# EAGLE design TheSixthSense (EAGLE 6.1)
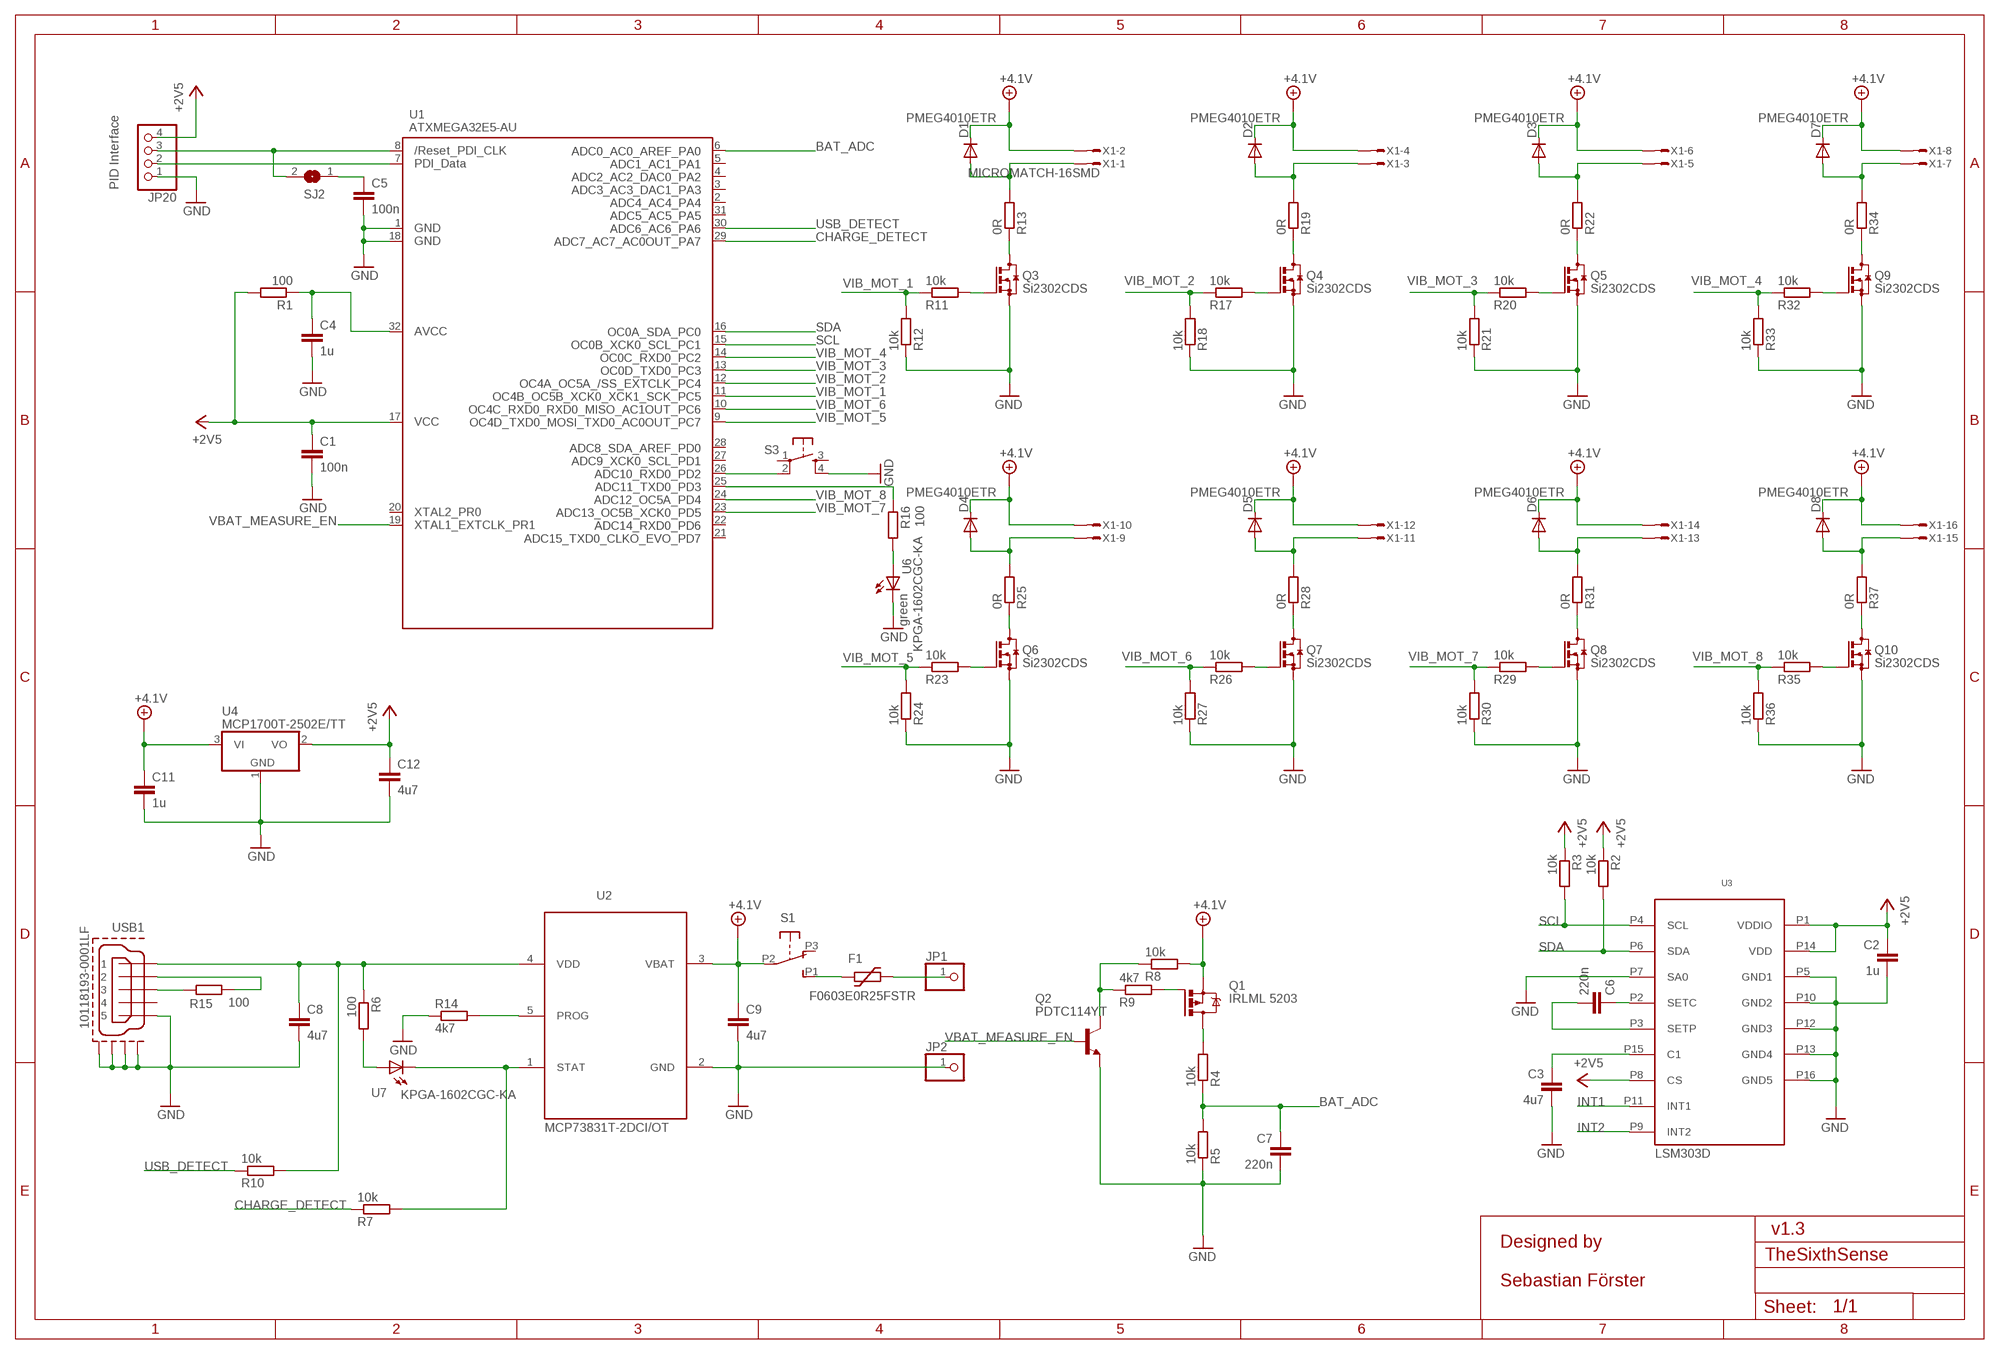
[diagram p0: schematic, sheet 1]

## Parts
C1  100n  C-EUC0603  [C0603]
C2  1u  C-EUC0603  [C0603]
C3  4u7  C-EUC0603  [C0603]
C4  1u  C-EUC0603  [C0603]
C5  100n  C-EUC0603  [C0603]
C6  220n  C-EUC0603  [C0603]
C7  220n  C-EUC0603  [C0603]
C8  4u7  C-EUC0603  [C0603]
C9  4u7  C-EUC0603  [C0603]
C11  1u  C-EUC0603  [C0603]
C12  4u7  C-EUC0603  [C0603]
D1  PMEG4010ETR  MBR0520LT  [SOD123]
D2  PMEG4010ETR  MBR0520LT  [SOD123]
D3  PMEG4010ETR  MBR0520LT  [SOD123]
D4  PMEG4010ETR  MBR0520LT  [SOD123]
D5  PMEG4010ETR  MBR0520LT  [SOD123]
D6  PMEG4010ETR  MBR0520LT  [SOD123]
D7  PMEG4010ETR  MBR0520LT  [SOD123]
D8  PMEG4010ETR  MBR0520LT  [SOD123]
F1  F0603E0R25FSTR  PMS1812  [R0603]
JP1  PINHD-1X1  [1X01]
JP2  PINHD-1X1  [1X01]
JP20  PINHD-1X4_2.00  [1X04M]
Q1  IRLML 5203  IRLML5203  [MICRO3]
Q2  PDTC114YT  BC848ALT1SMD  [SOT23]
Q3  Si2302CDS  BSS123  [SOT23]
Q4  Si2302CDS  BSS123  [SOT23]
Q5  Si2302CDS  BSS123  [SOT23]
Q6  Si2302CDS  BSS123  [SOT23]
Q7  Si2302CDS  BSS123  [SOT23]
Q8  Si2302CDS  BSS123  [SOT23]
Q9  Si2302CDS  BSS123  [SOT23]
Q10  Si2302CDS  BSS123  [SOT23]
R1  100  R-EU_R0603  [R0603]
R2  10k  R-EU_R0603  [R0603]
R3  10k  R-EU_R0603  [R0603]
R4  10k  R-EU_R0603  [R0603]
R5  10k  R-EU_R0603  [R0603]
R6  100  R-EU_R0603  [R0603]
R7  10k  R-EU_R0603  [R0603]
R8  10k  R-EU_R0603  [R0603]
R9  4k7  R-EU_R0603  [R0603]
R10  10k  R-EU_R0603  [R0603]
R11  10k  R-EU_R0603  [R0603]
R12  10k  R-EU_R0603  [R0603]
R13  0R  R-EU_R0603  [R0603]
R14  4k7  R-EU_R0603  [R0603]
R15  100  R-EU_R0603  [R0603]
R16  100  R-EU_R0603  [R0603]
R17  10k  R-EU_R0603  [R0603]
R18  10k  R-EU_R0603  [R0603]
R19  0R  R-EU_R0603  [R0603]
R20  10k  R-EU_R0603  [R0603]
R21  10k  R-EU_R0603  [R0603]
R22  0R  R-EU_R0603  [R0603]
R23  10k  R-EU_R0603  [R0603]
R24  10k  R-EU_R0603  [R0603]
R25  0R  R-EU_R0603  [R0603]
R26  10k  R-EU_R0603  [R0603]
R27  10k  R-EU_R0603  [R0603]
R28  0R  R-EU_R0603  [R0603]
R29  10k  R-EU_R0603  [R0603]
R30  10k  R-EU_R0603  [R0603]
R31  0R  R-EU_R0603  [R0603]
R32  10k  R-EU_R0603  [R0603]
R33  10k  R-EU_R0603  [R0603]
R34  0R  R-EU_R0603  [R0603]
R35  10k  R-EU_R0603  [R0603]
R36  10k  R-EU_R0603  [R0603]
R37  0R  R-EU_R0603  [R0603]
S1  ALPSSSSS811101  [SSSS811101]
S3  10-XX  [SKSCLAE010]
SJ2  SJ  [SJ]
U1  ATXMEGA32E5-AU  AVR_XMEGA_E  [TQFP32-08]
U2  MCP73831  [SOT23-5L]
U3  LSM303D  [LGA3X3_16L]
U4  MCP1700T-2502E/TT  XC6206P332MR  [SOT23]
U6  KPGA-1602CGC-KA  APA1606SURCK  [CHIP-LED0603]
U7  KPGA-1602CGC-KA  APA1606SURCK  [CHIP-LED0603]
USB1  10118193-0001LF  MOLEX-47346-0001  [MOLEX-47364-0001]
X1  MICROMATCH-16SMD  [MICROMATCH-16SMD]

## Nets
+3V3: C1.1 C2.1 C12.1 JP20.4 R1.2 R2.1 R3.1 U1.17(VCC3) U3.P1(VDDIO) U3.P8(CS) U3.P14(VDD) U4.2(VO) ; supply symbol labelled +2V5
+4.1V: C9.1 C11.1 D1.C D2.C D3.C D4.C D5.C D6.C D7.C D8.C Q1.2(S) R8.2 S1.P2(P) U2.3(VBAT) U4.3(VI) X1.1 X1.3 X1.5 X1.7 X1.9 X1.11 X1.13 X1.15
BAT_ADC: C7.1 R4.1 R5.2 U1.6(PA0)
CHARGE_DETECT: R7.1 U1.29(PA7)
GND: C1.2 C2.2 C3.2 C4.2 C5.2 C7.2 C8.2 C9.2 C11.2 C12.2 JP2.1 JP20.1 Q2.2(E) Q3.2(S) Q4.2(S) Q5.2(S) Q6.2(S) Q7.2(S) Q8.2(S) Q9.2(S) Q10.2(S) R5.1 R12.1 R14.1 R18.1 R21.1 R24.1 R27.1 R30.1 R33.1 R36.1 S3.4(S1) U1.1(GND1) U1.18(GND2) U2.2(GND) U3.P5(GND1) U3.P7(SA0) U3.P10(GND2) U3.P12(GND3) U3.P13(GND4) U3.P16(GND5) U4.1(GND) U6.C USB1.5 USB1.GND1 USB1.GND2 USB1.GND3 USB1.GND4
GPS_ENABLE: Q2.3(C) R8.1 R9.1
INT1: U3.P11(INT1)
INT2: U3.P9(INT2)
N$1: C6.2 U3.P3(SETP)
N$2: Q1.3(D) R4.2
N$3: C3.1 U3.P15(C1)
N$4: C6.1 U3.P2(SETC)
N$5: F1.1 S1.P1(S)
N$6: R6.2 U7.A
N$7: C8.1 R6.1 R10.2 U2.4(VDD) USB1.1
N$8: C5.1 SJ2.1
N$9: C4.1 R1.1 U1.32(AVCC)
N$10: JP20.3 SJ2.2 U1.8(RESET)
N$11: JP20.2 U1.7(PDI_DATA)
N$12: R14.2 U2.5(PROG)
N$13: R15.1 USB1.3
N$14: Q1.1(G) R9.2
N$15: Q3.1(G) R11.2
N$16: Q3.3(D) R13.1
N$17: D1.A R13.2 X1.16
N$18: R15.2 USB1.2
N$19: Q4.1(G) R17.2
N$20: Q4.3(D) R19.1
N$21: D2.A R19.2 X1.14
N$22: Q5.1(G) R20.2
N$23: Q5.3(D) R22.1
N$24: D3.A R22.2 X1.12
N$25: Q6.1(G) R23.2
N$26: R16.2 U6.A
N$27: Q6.3(D) R25.1
N$28: D4.A R25.2 X1.8
N$29: Q7.1(G) R26.2
N$30: Q7.3(D) R28.1
N$31: D5.A R28.2 X1.6
N$32: Q8.1(G) R29.2
N$33: Q8.3(D) R31.1
N$34: D6.A R31.2 X1.4
N$35: F1.2 JP1.1
N$36: S3.2(P1) U1.26(PD2)
N$38: R16.1 U1.25(PD3)
N$43: Q9.1(G) R32.2
N$44: Q9.3(D) R34.1
N$45: D7.A R34.2 X1.10
N$46: Q10.1(G) R35.2
N$47: Q10.3(D) R37.1
N$48: D8.A R37.2 X1.2
NNNN: R7.2 U2.1(STAT) U7.C
SCL: R3.2 U1.15(PC1) U3.P4(SCL)
SDA: R2.2 U1.16(PC0) U3.P6(SDA)
USB_DETECT: R10.1 U1.30(PA6)
VBAT_MEASURE_EN: Q2.1(B) U1.19(PR1)
VIB_MOT_1: R11.1 R12.2 U1.11(PC5)
VIB_MOT_2: R17.1 R18.2 U1.12(PC4)
VIB_MOT_3: R20.1 R21.2 U1.13(PC3)
VIB_MOT_4: R32.1 R33.2 U1.14(PC2)
VIB_MOT_5: R23.1 R24.2 U1.9(PC7)
VIB_MOT_6: R26.1 R27.2 U1.10(PC6)
VIB_MOT_7: R29.1 R30.2 U1.23(PD5)
VIB_MOT_8: R35.1 R36.2 U1.24(PD4)
Unconnected: S1.P3(O) S3.1(P) S3.3(S) U1.2(PA4) U1.3(PA3) U1.4(PA2) U1.5(PA1) U1.20(PR0) U1.21(PD7) U1.22(PD6) U1.27(PD1) U1.28(PD0) U1.31(PA5) USB1.4

## Notes on the sheet
- PID Interface
- green
- MCP73831T-2DCI/OT
- LSM303D
- v1.3
- Designed by
- Sebastian Förster

## Library data of the parts
C1-C9 C11 C12 = rcl:C-EU: CAPACITOR, European symbol
D1-D8 = diode:MBR0520LT: SCHOTTKY BARRIER RECTIFIER Source: http://onsemi.com .. MBR0520LT1-D.pdf
F1 = ptc-littlefuse:PMS1812: PMS1812-050 PPTC .5A 15V 1812
JP1 JP2 = pinhead:PINHD-1X1: PIN HEADER
JP20 = pinhead:PINHD-1X4: PIN HEADER
Q1 = transistor-power:IRLML5203: HEXFET P-Channel Power MOSFET
Q2 = transistor-npn:BC848*: NPN Transistor
Q3-Q10 = transistor-small-signal:BSS123: N-CHANNEL MOS FET
R1-R37 = rcl:R-EU_: RESISTOR, European symbol
S1 = ALP_Switch:ALPSSSSS811101
S3 = smd_right_switch:10-XX: OMRON SWITCH
SJ2 = jumper:SJ: SMD solder JUMPER
U1 = xmega:AVR_XMEGA_E
U2 = MCP73831:MCP73831
U3 = LSM303D:LSM303D
U4 = LDO_AAT3220:XC6206P332MR
U6 U7 = led_sideview:APA1606SURCK
USB1 = usb_con-update:MOLEX-47346-0001: MICRO USB B, BOTTOM MOUNT
X1 = Con-amp-micromatch:MICROMATCH-16: MicroMaTch 16 8-215464-6 / 1-215464-6 Drawing Number C-215464 DDEController.pdf

## Board
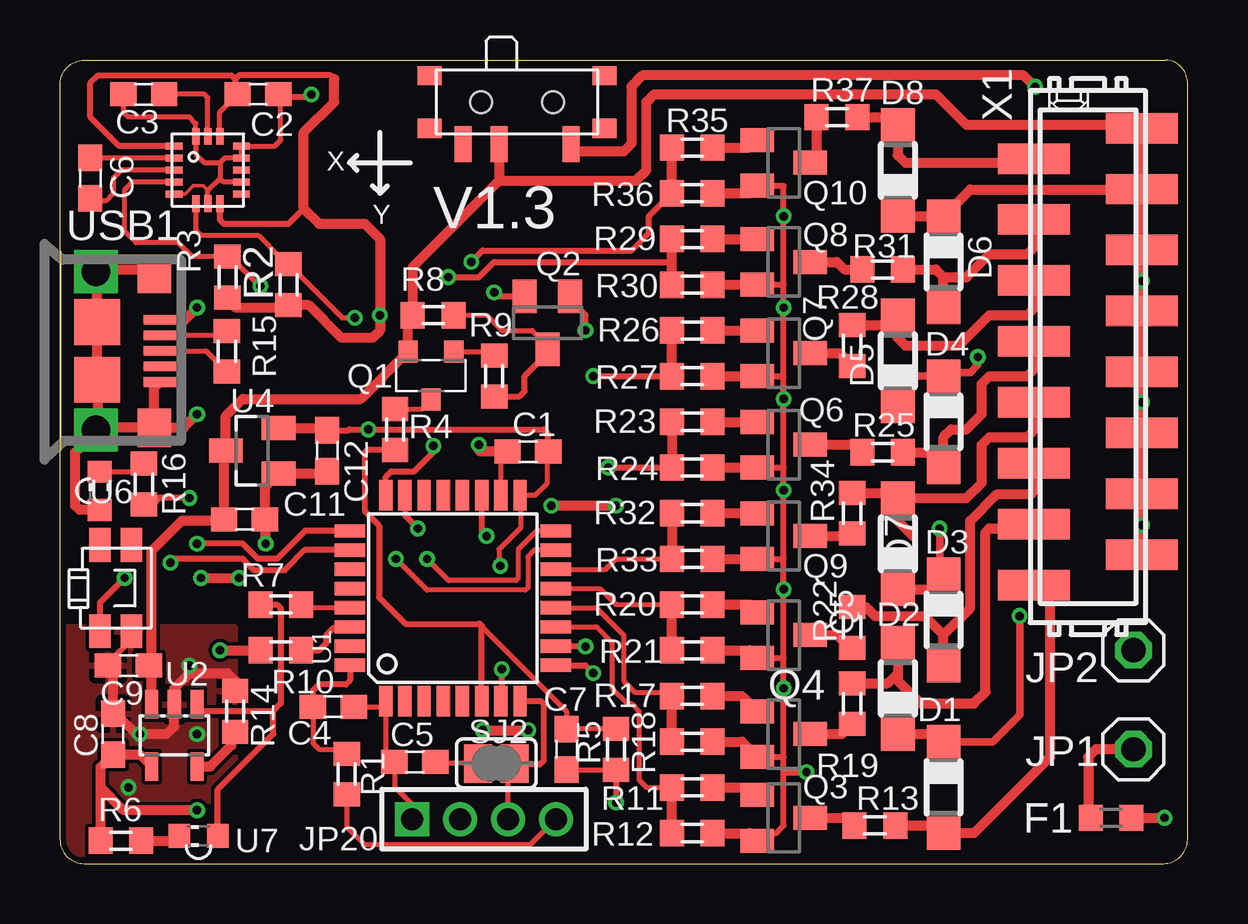
[diagram p1: board, top side]
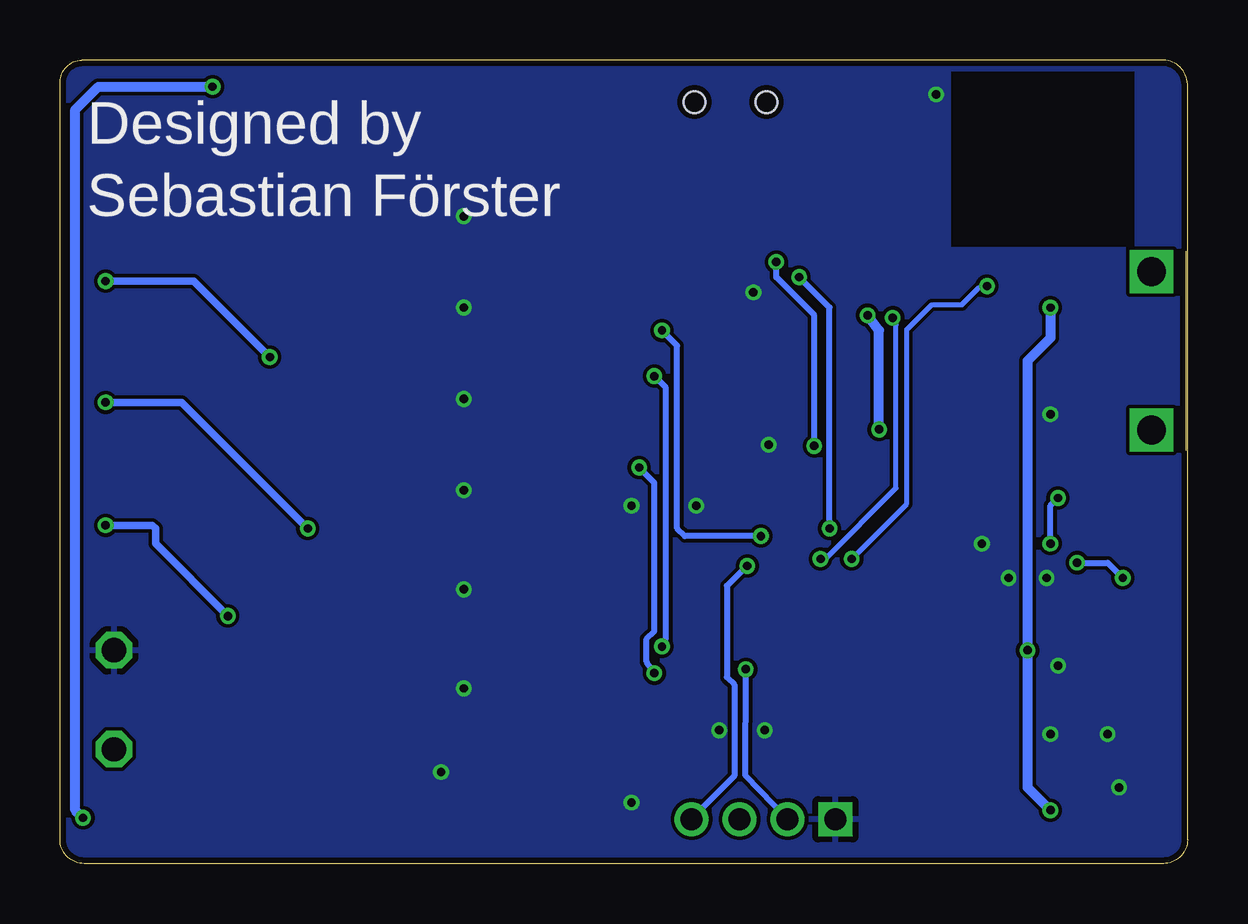
[diagram p2: board, bottom side, seen from below]

Size 47 x 33.5 mm. Coordinates in mm from the lower left corner, seen from the top.
Outline: 1,0 46,0 arc90 47,1 47,32.5 arc90 46.1,33.5 1.1,33.5 arc90 0,32.5 0,1 arc90 1,0
Copper layers (1*16): Top 0.035mm / dielectric 1.5mm / Bottom 0.035mm
Design rules: minimum track width 6mil, minimum drill 12mil, track to track 6mil, track to pad 6mil, pad to pad 6mil, via to via 6mil, smd to smd 0mil, copper to edge 10mil, drill to drill 10mil, minimum pad ring 10mil, minimum via ring 6mil, stop-mask expansion 2mil, vias tented up to drill 14mil, thermal gap 10mil
bRestrict: area 2.2,25.7 to 9.8,33

### Footprints (pad centres in the part's own frame; a part is rotated, then mirrored left to right if it is on the bottom)
C0603 = smd 1.1 x 1: 1 -0.85,0; 2 0.85,0
SOD123 = smd 1.4 x 1.4: A 1.9,0; C -1.9,0
R0603 = smd 1 x 1.1: 1 -0.85,0; 2 0.85,0
1X01 = drill 1.016 octagon: 1 0,0
1X04M = drill 0.914 square: 1 -3,0 | drill 0.914: 2 -1,0; 3 1,0; 4 3,0
MICRO3 = smd 0.8 x 0.9: 1 -0.95,-1; 2 0.95,-1; 3 0,1
SOT23 = smd 1 x 1.4: 1 -0.95,-1.1; 2 0.95,-1.1; 3 0,1.1
SSSS811101 = smd 0.7 x 1.5: P1 -2.25,1.75; P2 0.75,1.75; P3 2.25,1.75 | smd 1 x 0.8: P1_GND -3.65,1.1; P1_GND1 -3.65,-1.1; P1_GND2 3.65,1.1; P1_GND3 3.65,-1.1 | hole 0.9: -1.5,0; 1.5,0
SKSCLAE010 = smd 1.4 x 0.9: 1 -1.85,-0.55; 2 1.75,-0.55; 3 -1.85,0.75; 4 1.75,0.75
SJ = smd 1.168 x 1.6: 1 -0.762,0; 2 0.762,0
TQFP32-08 = smd 1.27 x 0.559: 1 -4.293,2.8; 2 -4.293,2; 3 -4.293,1.2; 4 -4.293,0.4; 5 -4.293,-0.4; 6 -4.293,-1.2; 7 -4.293,-2; 8 -4.293,-2.8; 17 4.293,-2.8; 18 4.293,-2; 19 4.293,-1.2; 20 4.293,-0.4; 21 4.293,0.4; 22 4.293,1.2; 23 4.293,2; 24 4.293,2.8 | smd 0.559 x 1.27: 9 -2.8,-4.293; 10 -2,-4.293; 11 -1.2,-4.293; 12 -0.4,-4.293; 13 0.4,-4.293; 14 1.2,-4.293; 15 2,-4.293; 16 2.8,-4.293; 25 2.8,4.293; 26 2,4.293; 27 1.2,4.293; 28 0.4,4.293; 29 -0.4,4.293; 30 -1.2,4.293; 31 -2,4.293; 32 -2.8,4.293
SOT23-5L = smd 0.55 x 1.2: 1 -0.95,-1.3; 2 0,-1.3; 3 0.95,-1.3; 4 0.95,1.3; 5 -0.95,1.3
LGA3X3_16L = smd 0.7 x 0.3: P1 -1.4,1; P2 -1.4,0.5; P3 -1.4,0; P4 -1.4,-0.5; P5 -1.4,-1; P9 1.4,-1; P10 1.4,-0.5; P11 1.4,0; P12 1.4,0.5; P13 1.4,1 | smd 0.3 x 0.7: P6 -0.5,-1.4; P7 0,-1.4; P8 0.5,-1.4; P14 0.5,1.4; P15 0,1.4; P16 -0.5,1.4
CHIP-LED0603 = smd 1 x 0.9: A 0,0.8; C 0,-0.8
MOLEX-47364-0001 = smd 1.35 x 0.4: 1 2.67,1.3; 2 2.67,0.65; 3 2.67,0; 4 2.67,-0.65; 5 2.67,-1.3 | smd 1.9 x 1.9: GND1 0.05,1.2; GND4 0.05,-1.2 | smd 1.4 x 1.6: GND2 2.43,3.2; GND3 2.43,-3.2 | drill 1.2 square: P$1 0,-3.3; P$2 0,3.3
MICROMATCH-16SMD = smd 1.27 x 3: 1 9.525,-2.25; 2 8.255,2.25; 3 6.985,-2.25; 4 5.715,2.25; 5 4.445,-2.25; 6 3.175,2.25; 7 1.905,-2.25; 8 0.635,2.25; 9 -0.635,-2.25; 10 -1.905,2.25; 11 -3.175,-2.25; 12 -4.445,2.25; 13 -5.715,-2.25; 14 -6.985,2.25; 15 -8.255,-2.25; 16 -9.525,2.25

### Placement (x,y rotation side)
C1  19.5,17.18 180 top
C2  8.26,32.07 0 top
C3  3.49,32.07 180 top
C4  11.39,6.53 0 top
C5  14.79,4.24 180 top
C6  1.27,28.57 270 top
C7  21.11,4.76 270 top
C8  2.22,5.4 90 top
C9  2.86,8.26 180 top
C11  7.7,14.35 0 top
C12  11.14,17.21 270 top
D1  36.83,3.17 270 top
D2  34.92,7.3 90 top
D3  36.83,10.16 270 top
D4  36.83,18.41 270 top
D5  34.92,20.95 90 top
D6  36.83,25.08 270 top
D7  34.92,13.34 90 top
D8  34.92,28.89 90 top
F1  43.81,1.91 180 top
JP1  44.75,4.76 0 top
JP2  44.75,8.89 0 top
JP20  17.68,1.84 0 top
Q1  15.46,20.34 180 top
Q2  20.32,22.54 180 top
Q3  30.16,1.91 270 top
Q4  30.16,5.4 270 top
Q5  30.16,9.53 270 top
Q6  30.16,17.46 270 top
Q7  30.16,21.27 270 top
Q8  30.16,25.08 270 top
Q9  30.16,13.65 270 top
Q10  30.16,29.21 270 top
R1  11.96,3.73 270 top
R2  9.53,24.13 90 top
R3  6.99,24.45 90 top
R4  13.97,18.1 90 top
R5  23.18,4.76 90 top
R6  2.54,0.95 0 top
R7  9.21,10.79 180 top
R8  15.56,22.86 180 top
R9  18.1,20.32 90 top
R10  9.21,8.89 180 top
R11  26.35,3.17 0 top
R12  26.35,1.27 180 top
R13  33.97,1.59 0 top
R14  7.3,6.35 270 top
R15  6.96,21.36 90 top
R16  3.5,15.82 90 top
R17  26.35,6.99 0 top
R18  26.35,5.08 180 top
R19  33.02,6.67 90 top
R20  26.35,10.79 0 top
R21  26.35,8.89 180 top
R22  33.02,9.84 90 top
R23  26.35,18.41 0 top
R24  26.35,16.51 180 top
R25  34.29,17.14 0 top
R26  26.35,22.23 0 top
R27  26.35,20.32 180 top
R28  33.02,21.59 90 top
R29  26.35,26.04 0 top
R30  26.35,24.13 180 top
R31  34.29,24.77 0 top
R32  26.35,14.61 0 top
R33  26.35,12.7 180 top
R34  33.02,14.61 90 top
R35  26.35,29.84 0 top
R36  26.35,27.94 180 top
R37  32.38,31.11 0 top
S1  19.05,31.75 180 top
S3  2.22,11.43 270 top
SJ2  18.19,4.17 0 top
U1  16.38,11.06 90 top
U2  4.77,5.34 180 top
U3  6.16,28.91 0 top
U4  8.01,17.21 90 top
U6  1.66,15.54 0 top
U7  5.78,1.15 90 top
USB1  1.5,21.38 0 top
X1  42.85,21.13 90 top

### Tracks (layer width: path | path; a pad name or v marks a point on that pad's centre or on a via)
+3V3  (via drill 0.35)
  Top 0.203: C1.1 20.32,17.14 20.32,15.88 19.8,15.36 U1.17 19.2,15.34 19.2,14 18.3,13.1 18.3,12.7 18.4,12.38 18.38,12.41 v18.35,12.41 | R1.2 11.96,1.54 12.7,0.79 19.62,0.79 JP20.4 | U3.P14 6.66,31.32 7.04,31.7 C2.1
  Top 0.254: C12.1 12.03,18.06 12.06,18.1 v12.86,18.1 20.16,18.1 20.32,17.94 20.32,17.21 C1.1 | U3.P8 6.66,26.83 6.83,26.67 9.53,26.67 10.16,27.3 | U3.P1 2.47,29.91 1.27,31.11 1.27,32.54 1.59,32.86 7.14,32.86 7.3,32.7 | 7.3,32.7 7.3,31.96 7.04,31.7 | 11.43,32.7 11.27,32.86 7.46,32.86 7.3,32.7 | R3.1 6.99,23.5
  Top 0.406: U4.2 11.04,18.16 C12.1 | 11.43,32.7 11.43,31.75 10.16,30.48 10.16,27.3 10.79,26.67 12.7,26.67 13.34,26.04 v13.34,22.86 13.34,22.23 13.02,21.91 11.75,21.91 10.38,23.28 R2.1 9.53,23.18 7.3,23.18 6.99,23.5
  Bottom 0.254: v18.35,12.41 18.38,12.41 19.2,11.58 19.2,7.77 18.89,7.46 18.89,3.65 20.64,1.91 20.64,1.88 JP20.4 20.66,1.84
  Bottom 0.406: v12.86,18.1 12.86,22.23 v13.34,22.86
+4.1V  (via drill 0.35)
  Top 0.203: 14.52,22.73 R8.2
  Top 0.305: v40.01,10.32 40.01,6.19 38.89,5.08 D1.C | v36.67,13.97 36.67,12.22 D3.C | v38.26,21.11 38.26,20.8 37.94,20.48 36.99,20.48 D4.C 35.08,20.32 34.92,20.16 D5.C | 45.09,30.8 45.09,30.67 X1.1
  Top 0.406: D8.C 36.82,26.99 D6.C 37.94,28.1 44.8,28.1 X1.3 | D2.C 36.5,5.4 D1.C | D7.C 36.2,11.44 D3.C | 14.52,22.73 Q1.2 14.54,21.34 14.61,21.27 14.45,21.27 12.55,19.37 7.62,19.37 6.91,18.66 U4.3 6.84,17.14 C11.1 6.91,14.29 | U2.3 3.82,8.46 C9.1 3.81,8.57 3.81,13.02 5.08,14.29 6.91,14.29 | 6.99,14.29 6.91,14.29 | R8.2 14.71,24.87 18.3,28.46 | S1.P2 18.3,28.46 | 18.3,28.46 24.02,28.46 24.45,28.89 24.45,31.75 24.77,32.07 36.51,32.07 37.78,30.8 45.09,30.8 45.09,30.48 | X1.1 X1.3 | X1.3 X1.5 v45.1,24.28 X1.7 X1.9 v45.1,19.22 X1.11 X1.13 v45.1,14.1 X1.15
  Bottom 0.305: v45.1,14.1 43.15,14.1 43.02,13.97 43.02,13.34 v40.01,10.32 | v45.1,19.22 41.92,19.22 v36.67,13.97 | v45.1,24.28 41.43,24.28 v38.26,21.11
BAT_ADC
  Top 0.203: R5.2 C7.1 21.11,6.35 17.58,9.89 17.46,10
  Top 0.254: R4.1 12.8,17.25 12.7,17.14 12.7,14.7 13.3,14.1 13.3,11.1 14.4,10 17.46,10 | U1.6 17.58,9.89 17.59,9.89 17.6,9.9 17.5,10 17.46,10 | 17.46,10
CHARGE_DETECT
  Top 0.203: U1.29 10.19,10.66 R7.1
GND  (via drill 0.35)
  Top 0.152: U3.P5 5.21,27.91 5.56,28.26 5.97,28.26 6.16,28.07
  Top 0.203: U1.18 18.38,16.9 C1.2 | C7.2 R5.1 | C4.2 13.34,6.53 U1.1 13.58,4.6 C5.2 13.97,4.21 13.97,3.17 14.68,2.47 JP20.1 | C3.2 2.64,31.33 2.86,31.11 5.4,31.11 5.66,30.85 U3.P16 5.66,29.58 6.03,29.21 6.67,29.21 | C2.2 9.21,31.96 9.21,30.16 8.96,29.91 U3.P13 U3.P12 6.87,29.41 6.67,29.21 | U3.P10 6.83,28.41 6.67,28.57 | 6.67,29.21 6.67,28.57 | U3.P7 6.16,28.07 6.67,28.57
  Top 0.254: 9.21,31.96 10.38,31.96 v10.48,32.07 | R5.1 v23.18,2.54 | Q3.2 29.12,1.04 29.21,0.95 29.21,1.27 29.84,1.27 30.16,1.59 30.16,3.81 | 30.16,3.81 30.16,4.45 | 30.16,4.45 v30.16,7.3 30.16,8.57 | 30.16,8.57 v30.16,11.43 30.16,12.7 | 30.16,12.7 v30.16,15.56 30.16,16.51 | 30.16,16.51 v30.16,19.37 30.16,20.32 | 30.16,20.32 v30.16,23.18 30.16,24.13 | 30.16,24.13 v30.16,26.99 30.16,28.26 Q10.2 | 29.21,24.13 30.16,24.13 | Q7.2 30.16,20.32 | Q6.2 30.16,16.51 | Q5.2 30.16,8.57 | Q9.2 30.16,12.7 | Q4.2 30.16,4.45 | 30.16,3.81 v31.11,3.81 | Q2.2 18.27,23.64 v18.1,23.81 | 2.22,8.36 2.22,8.57 2.86,9.21 2.86,9.56 S3.4
  Top 0.406: R36.1 28.74,27.94 Q10.2 | R30.1 Q8.2 | Q8.2 29.21,24.13 Q8.2 | R27.1 Q7.2 | R24.1 Q6.2 | R33.1 Q9.2 | R18.1 28.43,5.08 Q4.2 | R21.1 28.75,8.89 Q5.2 | U6.C 0.82,14.74 0.64,14.92 0.64,17.14 1.59,18.1 | 1.98,8.29 C9.2 2.22,8.36 C8.2 2.33,6.25 3.17,5.4 v3.33,5.4 4.45,5.4 4.76,5.71 U2.2 4.77,7.31 5.4,7.94 6.99,7.94 7.3,7.62 R14.1 | C11.2 8.54,15.7 U4.1 11.04,16.26 C12.2 | 8.57,14.32 C11.2 | USB1.GND3 3.93,19.84 USB1.5 | 1.65,20.07 USB1.GND4 | USB1.GND4 USB1.GND1 1.55,24.73 1.59,24.77 3.74,24.77 USB1.GND2 | USB1.GND3 1.67,18.18 1.59,18.1 | 1.59,18.1 1.59,20.32 1.55,20.28 USB1.GND4 | USB1.GND3 5.16,18.18 v5.71,18.73 | C11.2 8.54,13.36 v8.57,13.34 | R12.1 28.75,1.27 Q3.2 | C1.2 17.5,17.18 v17.46,17.46 | v20.48,14.92 v23.18,14.92 | v5.87,11.91 v7.46,11.91 | v17.62,5.56 v19.53,5.56
  other vias: 5.71,5.4 5.4,8.26 2.86,3.17
  pour Bottom: 0,0 46.99,0 46.99,33.34 0,33.34
  pour Top: 0,9.53 0,0.64 0.64,0 7.3,0 7.3,9.84 0,9.84
GPS_ENABLE
  Top 0.203: R8.1 17.78,22.86 18.41,22.23 19.68,22.23 20,21.91 20,21.76 Q2.3
  Top 0.254: R9.1 19.15,19.47 19.37,19.68 19.37,20.32 20.32,21.27 Q2.3
N$1
  Top 0.203: U3.P3 2.56,28.91 2.22,28.57 2.22,27.94 1.91,27.62 1.37,27.62 C6.2
N$2
  Top 0.203: R4.2 15.07,18.95 Q1.3
N$3
  Top 0.203: U3.P15 6.16,31.94 6.03,32.07 C3.1
N$4
  Top 0.203: C6.1 4.75,29.43 U3.P2
N$5  (via drill 0.35)
  Top 0.406: S1.P1 21.27,29.97 21.27,29.84 21.43,29.69 23.5,29.69 23.81,30 23.81,32.38 24.29,32.86 40.16,32.86 v40.64,32.38 | F1.1 v46.04,1.91
  Bottom 0.406: v46.04,1.91 46.35,2.22 46.35,31.43 45.4,32.38 v40.64,32.38
N$6
  Top 0.406: R6.2 4.78,0.95 U7.A
N$7  (via drill 0.35)
  Top 0.406: R6.1 1.69,3.17 | 1.69,3.17 1.69,4.01 C8.1 3.31,4.55 U2.4 | USB1.1 5.21,22.68 v5.71,23.18 | v6.67,8.89 R10.2 | v5.71,2.22 2.64,2.22 1.69,3.17
  Bottom 0.406: v5.71,23.18 5.71,21.91 6.67,20.95 v6.67,8.89 6.67,3.17 v5.71,2.22
N$8
  Top 0.203: SJ2.1 15.7,4.17 C5.1
N$9
  Top 0.203: C4.1 10.54,5.01 10.79,4.76 11.75,4.76 11.96,4.55 | R1.1 11.96,4.55 | 11.96,4.55 12.06,4.45
  Top 0.254: U1.32 12.09,7.64 11.91,7.46 10.79,7.46 10.54,7.21 C4.1
N$10
  Top 0.203: JP20.3 18.68,3.9 SJ2.2
  Top 0.254: U1.8 20.06,6.77 20.16,6.67 20.16,4.29 20,4.13 19,4.13 SJ2.2
N$11  (via drill 0.35)
  Top 0.254: v18.41,8.1 18.41,6.81 U1.7
  Bottom 0.254: JP20.2 18.42,3.66 v18.41,8.1
N$12
  Top 0.406: U2.5 6.26,4.04 7.14,4.92 7.14,5.24 7.3,5.4 R14.2
N$13
  Top 0.203: USB1.3 6.09,21.38 R15.1
N$14
  Top 0.203: Q1.1 18.03,21.34 18.1,21.27 R9.2
N$15
  Top 0.406: R11.2 28.89,3.17 | 29.21,2.86 28.89,2.86 28.89,3.17 | 29.21,2.86 28.89,3.17 | Q3.1 29.21,2.85 29.21,2.86
N$16
  Top 0.406: Q3.3 32.7,1.91 33.02,1.59 R13.1
N$17
  Top 0.406: R13.2 36.52,1.59 D1.A 38.1,1.27 41.27,4.45 41.27,10.79 40.64,11.43 40.64,11.56 X1.16
N$18
  Top 0.203: USB1.2 6.79,22.02 R15.2 | R15.2 | R15.2 6.99,22.23
N$19
  Top 0.406: R17.2 28.43,6.99 Q4.1
N$20
  Top 0.406: Q4.3 32.6,5.4 R19.1
N$21
  Top 0.406: D2.A 34.92,7.94 | 34.92,7.94 34.92,7.62 35.88,6.67 38.1,6.67 38.58,7.14 38.58,13.81 38.73,13.97 40.42,13.97 X1.14 | R19.2 34.51,7.52 34.92,7.94
N$22
  Top 0.406: R20.2 28.74,10.79 Q5.1
N$23
  Top 0.406: Q5.3 32.38,9.53 33.02,8.89 R22.1
N$24
  Top 0.406: D3.A 36.83,9.53 | R22.2 33.6,10.69 33.97,10.32 36.04,10.32 36.83,9.53 | 36.83,9.53 37.94,10.64 37.94,14.29 39.05,15.4 40.48,15.4 40.64,15.56 40.64,16.64 X1.12
N$25
  Top 0.406: R23.2 Q6.1
N$26
  Top 0.203: U6.A 3.49,16.34 R16.2
N$27
  Top 0.406: Q6.3 33.12,17.46 R25.1
N$28
  Top 0.305: 36.83,16.67 D4.A
  Top 0.406: R25.2 36.2,17.14 D4.A | D4.A 36.83,16.67 36.83,17.78 37.15,18.1 37.78,18.1 38.42,18.73 38.42,20 38.73,20.32 40.32,20.32 40.64,20.64 40.64,21.72 X1.8
N$29
  Top 0.406: 28.89,22.23 29.21,22.23 29.21,22.22 Q7.1 R26.2
N$30
  Top 0.406: Q7.3 32.49,21.27 R28.1
N$31
  Top 0.406: R28.2 34.51,22.44 D5.A 34.92,21.91 35.24,21.59 37.47,21.59 38.73,22.86 40.32,22.86 40.64,23.18 40.64,24.26 X1.6
N$32
  Top 0.406: R29.2 Q8.1
N$33
  Top 0.406: Q8.3 32.38,25.08 32.7,24.77 R31.1
N$34
  Top 0.406: D6.A 36.83,24.45 | R31.2 36.51,24.77 36.83,24.45 | 36.83,24.45 37.78,24.45 38.73,25.4 40.32,25.4 40.64,25.72 40.64,26.8 X1.4
N$35
  Top 0.406: JP1.1 43.18,4.76 42.86,4.45 42.86,1.91 F1.2 43.18,1.91
N$36  (via drill 0.35)
  Top 0.254: U1.26 10.21,13.06 9.37,12.22 8.1,12.22 7.62,12.7 4.76,12.7 v4.6,12.54 | v2.7,11.91 1.67,10.88 S3.2
  Bottom 0.254: v4.6,12.54 3.33,12.54 v2.7,11.91
N$38  (via drill 0.35)
  Top 0.254: U1.25 10.21,13.87 9.05,12.7 8.26,12.7 7.62,13.34 v5.71,13.34 | v5.4,15.24 4.13,15.24 3.5,14.61 | R16.1 3.5,14.61 | 3.5,14.61 3.49,14.61
  Bottom 0.254: v5.71,13.34 5.71,14.92 v5.4,15.24
N$43
  Top 0.406: R32.2 Q9.1
N$44
  Top 0.406: Q9.3 32.92,13.65 R34.1
N$45
  Top 0.406: D7.A 34.92,14.29 35.56,13.65 | R34.2 34.7,15.46 D7.A | D7.A 37.78,15.23 38.42,15.88 38.42,17.46 38.73,17.78 40.32,17.78 40.64,18.1 40.64,19.18 X1.10
N$46
  Top 0.406: R35.2 28.75,29.84 Q10.1
N$47
  Top 0.406: R37.1 31.54,29.48 Q10.3
N$48
  Top 0.254: D8.A
  Top 0.406: R37.2 34.61,31.11 D8.A | D8.A 34.92,29.53 35.24,29.21 40.32,29.21 40.6,29.48 | X1.2 40.6,29.48 | 40.6,29.48 40.64,29.53
NNNN
  Top 0.254: R7.2 9.05,10.79 9.21,10.64 9.21,6.67 8.89,6.35 | 8.89,6.35 5.71,6.35 U2.1 | U7.C 6.58,3.08 8.89,5.4 8.89,6.35 | 5.71,6.67 U2.1 | U2.1
  Top 0.406: U2.1
SCL  (via drill 0.35)
  Top 0.203: U1.15 19.77,13.06 19.5,12.8 19.5,11.5 19.4,11.4 15.3,11.4 v14,12.7 | U3.P4 3.01,28.41 2.7,28.1 2.7,26.35 3.17,25.88 4.92,25.88 5.5,25.3 R3.2 7.09,25.3 8.31,24.07 v8.36,24.07
  Bottom 0.203: v14,12.7 | v14,12.7 11.7,15 11.7,22.27 10.66,23.3 9.4,23.3 8.68,24.02 v8.36,24.07
SDA  (via drill 0.35)
  Top 0.203: U1.16 19.86,13.87 19.1,13.1 19.1,11.9 19,11.8 16.2,11.8 v15.3,12.7 | U3.P6 5.66,26.41 5.87,26.19 8.26,26.19 9.21,25.24 9.26,25.24 R2.2 11.75,22.75 v12.29,22.75
  Bottom 0.203: v15.3,12.7 15.1,12.7 12.15,15.65 12.15,22.45 v12.29,22.75
USB_DETECT
  Top 0.254: R10.1 10.79,8.89 11.11,9.21 11.11,9.53 11.43,9.84 12.06,9.84 U1.30
VBAT_MEASURE_EN  (via drill 0.35)
  Top 0.254: U1.19 17.58,13.86 v17.78,13.65 | v21.91,22.23 21.91,22.86 21.27,23.5 | 21.27,23.5 21.27,23.81 | Q2.1 21.27,23.5
  Bottom 0.254: v17.78,13.65 20.95,13.65 21.27,13.97 21.27,21.59 v21.91,22.23
VIB_MOT_1
  Top 0.203: U1.11 22.36,9.87 23.02,9.21 23.02,7.3 23.65,6.67 23.81,6.67 24.13,6.35 24.13,3.49 24.45,3.17 R11.1 25.72,3.17
  Top 0.406: R12.2 R11.1
VIB_MOT_2
  Top 0.203: U1.12 22.36,10.66 23.5,9.53 23.5,7.62 23.97,7.14 25.34,7.14 R17.1
  Top 0.406: R18.2 R17.1
VIB_MOT_3
  Top 0.203: U1.13 22.51,11.46 23.18,10.79 R20.1
  Top 0.406: R21.2 R20.1
VIB_MOT_4
  Top 0.203: U1.14 22.74,12.27 23.18,12.7 R33.2
  Top 0.406: R32.1 R33.2
VIB_MOT_5  (via drill 0.35)
  Top 0.254: U1.9 21.9,8.27 v22.23,7.94 | v22.86,16.51 R24.2
  Top 0.406: R23.1 R24.2
  Bottom 0.254: v22.23,7.94 22.54,8.41 22.54,9.37 22.23,9.68 22.23,15.88 v22.86,16.51
VIB_MOT_6  (via drill 0.35)
  Top 0.254: U1.10 21.73,9.06 v21.91,9.05 | v22.23,20.32 R27.2
  Top 0.406: R27.2 R26.1
  Bottom 0.254: v21.91,9.05 21.75,9.37 21.75,19.84 v22.23,20.32
VIB_MOT_7  (via drill 0.35)
  Top 0.254: U1.23 14.38,14.52 v14.92,13.97 | v16.19,24.45 17.46,24.45 18.1,25.08 25.5,25.08
  Top 0.406: R30.2 25.5,25.08 R29.1
  Bottom 0.254: v14.92,13.97 14.92,23.18 v16.19,24.45
VIB_MOT_8  (via drill 0.35)
  Top 0.254: U1.24 13.58,16.12 13.81,16.35 14.76,16.35 15.56,17.14 v15.56,17.41 15.56,17.46 | R36.2 24.55,26.99 24.55,26.3 23.81,25.56 17.62,25.56 v17.14,25.08
  Top 0.406: R36.2 R35.1
  Bottom 0.254: v15.56,17.41 15.56,22.86 17.14,24.45 v17.14,25.08

### Text on the board
bPlace: Designed by | Sebastian Förster
tNames: X | Y | V1.3